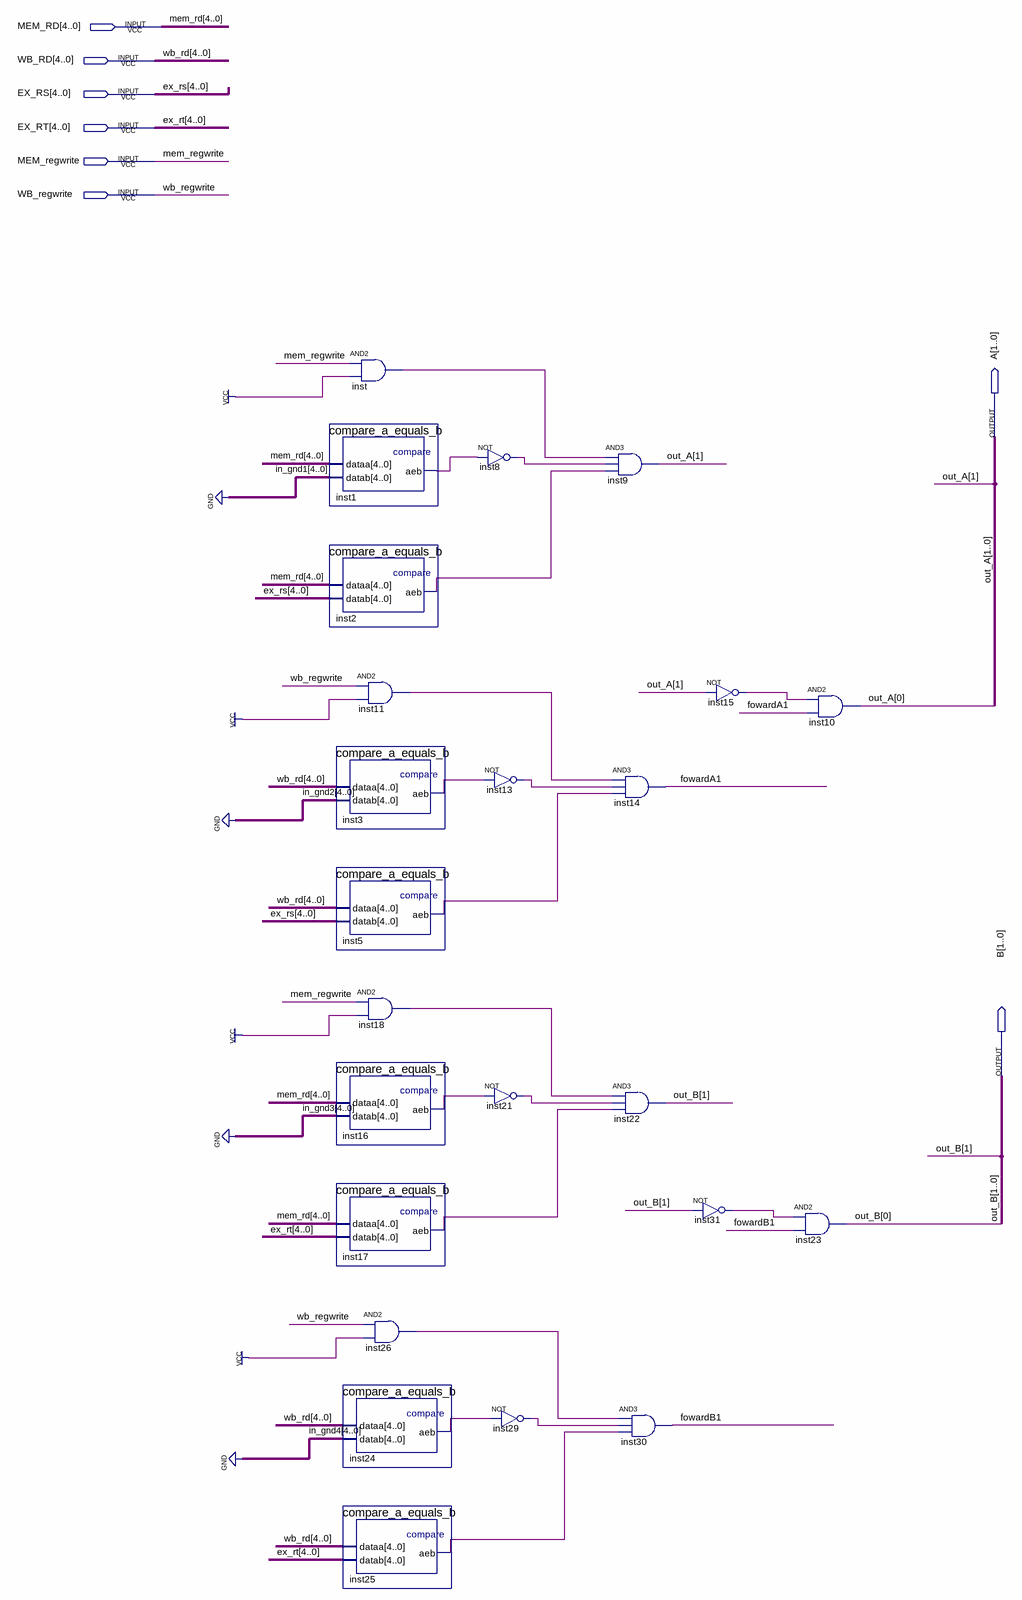
[diagram p0: schematic sheet]
// Quartus schematic unidade_forward.bdf as structural Verilog: 24 symbols, 8 pins
module unidade_forward (
  input  [4:0] MEM_RD,
  input  [4:0] WB_RD,
  input  [4:0] EX_RS,
  input  [4:0] EX_RT,
  input  MEM_regwrite,
  input  WB_regwrite,
  output [1:0] A,
  output [1:0] B
);

  wire fowardA1, fowardB1, inst1_aeb, inst2_aeb, inst3_aeb, inst5_aeb, inst8_out, inst11_out, inst13_out,
       inst15_out, inst16_aeb, inst17_aeb, inst18_out, inst21_out, inst24_aeb, inst25_aeb, inst26_out,
       inst29_out, inst31_out, inst_out;

  compare_a_equals_b inst1 (.dataa(MEM_RD), .datab({5{1'b0}}), .aeb(inst1_aeb));
  compare_a_equals_b inst2 (.dataa(MEM_RD), .datab(EX_RS), .aeb(inst2_aeb));
  and inst (inst_out, MEM_regwrite, 1'b1);
  and inst11 (inst11_out, WB_regwrite, 1'b1);
  compare_a_equals_b inst3 (.dataa(WB_RD), .datab({5{1'b0}}), .aeb(inst3_aeb));
  compare_a_equals_b inst5 (.dataa(WB_RD), .datab(EX_RS), .aeb(inst5_aeb));
  and inst18 (inst18_out, MEM_regwrite, 1'b1);
  compare_a_equals_b inst16 (.dataa(MEM_RD), .datab({5{1'b0}}), .aeb(inst16_aeb));
  compare_a_equals_b inst17 (.dataa(MEM_RD), .datab(EX_RT), .aeb(inst17_aeb));
  and inst26 (inst26_out, WB_regwrite, 1'b1);
  compare_a_equals_b inst24 (.dataa(WB_RD), .datab({5{1'b0}}), .aeb(inst24_aeb));
  compare_a_equals_b inst25 (.dataa(WB_RD), .datab(EX_RT), .aeb(inst25_aeb));
  not inst8 (inst8_out, inst1_aeb);
  not inst13 (inst13_out, inst3_aeb);
  not inst21 (inst21_out, inst16_aeb);
  not inst29 (inst29_out, inst24_aeb);
  and inst9 (A[1], inst_out, inst8_out, inst2_aeb);
  and inst14 (fowardA1, inst11_out, inst13_out, inst5_aeb);
  and inst22 (B[1], inst18_out, inst21_out, inst17_aeb);
  and inst30 (fowardB1, inst26_out, inst29_out, inst25_aeb);
  not inst15 (inst15_out, A[1]);
  not inst31 (inst31_out, B[1]);
  and inst10 (A[0], inst15_out, fowardA1);
  and inst23 (B[0], inst31_out, fowardB1);

  // Other names for the same wires on the sheet: out_A[1:0] = A; out_B[1:0] = B
endmodule
